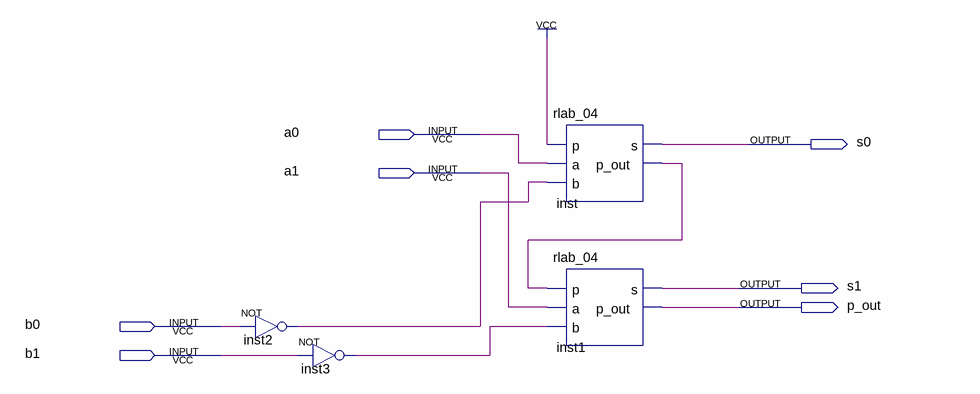
[diagram p0: schematic sheet]
// Quartus schematic sum_-.bdf as structural Verilog: 4 symbols, 7 pins
module \sum_-  (
  input  a0,
  input  a1,
  input  b0,
  input  b1,
  output s0,
  output s1,
  output p_out
);

  wire inst2_out, inst3_out, inst_p_out;

  not inst2 (inst2_out, b0);
  not inst3 (inst3_out, b1);
  rlab_04 inst (.p(1'b1), .a(a0), .b(inst2_out), .s(s0), .p_out(inst_p_out));
  rlab_04 inst1 (.p(inst_p_out), .a(a1), .b(inst3_out), .s(s1), .p_out(p_out));
endmodule
